# EAGLE design controller4 (EAGLE 8.0.1)

## Sheet 1 of 2
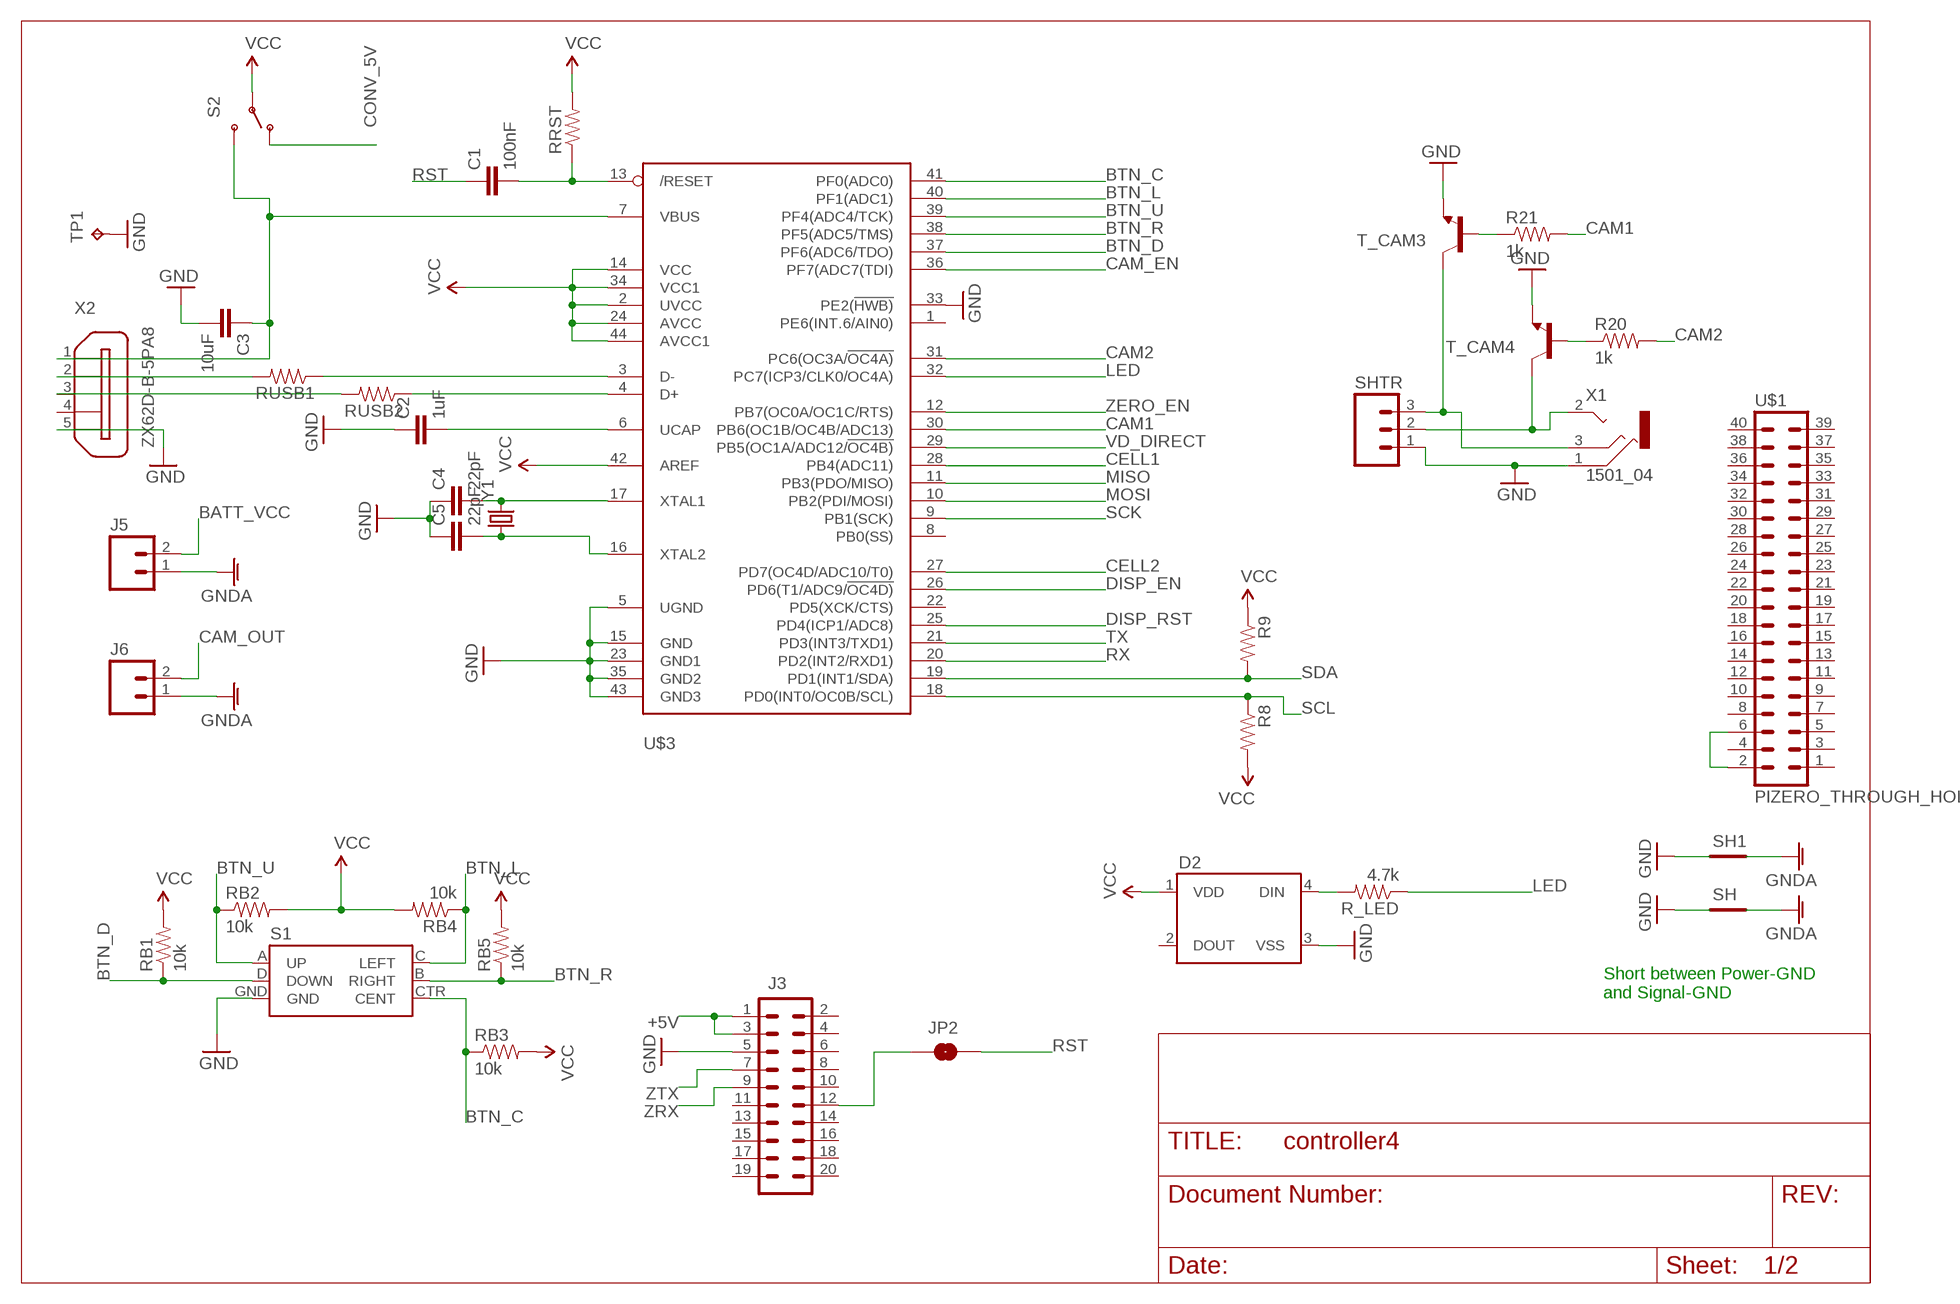
[diagram p0: schematic, sheet 1]

### Parts
C1  100nF  CAP1206  [1206]
C2  1uF  CAP1206  [1206]
C3  10uF  CAP1206  [1206]
C4  22pF  CAP1206  [1206]
C5  22pF  CAP1206  [1206]
D2  WS2812B  [WS2812B]
J3  M10X2  [2X10]
J5  M023.5MM_LOCK  [SCREWTERMINAL-3.5MM-2_LOCK]
J6  M023.5MM_LOCK  [SCREWTERMINAL-3.5MM-2_LOCK]
JP2  JUMPER-PAD-2-NOYES_SILK  [PAD-JUMPER-2-NO_YES_SILK]
R8  RESISTOR1206  [1206]
R9  RESISTOR1206  [1206]
R20  1k  RESISTOR1206  [1206]
R21  1k  RESISTOR1206  [1206]
R_LED  4.7k  RESISTOR1206  [1206]
RB1  10k  RESISTOR1206  [1206]
RB2  10k  RESISTOR1206  [1206]
RB3  10k  RESISTOR1206  [1206]
RB4  10k  RESISTOR1206  [1206]
RB5  10k  RESISTOR1206  [1206]
RRST  RESISTOR1206  [1206]
RUSB1  RESISTOR1206  [1206]
RUSB2  RESISTOR1206  [1206]
S1  JOYSTICK_MINI  [JOYSTICK_MINI]
S2  SWITCH-SPDTPTH_LOCK  [SWITCH-SPDT_LOCK.007S]
SH  SHORT-HT5  [SHORT_TOP-50]
SH1  SHORT-HT5  [SHORT_TOP-50]
SHTR  M03LOCK  [1X03_LOCK]
T_CAM3  TRANSISTOR_NPN2N3904  [TO-92]
T_CAM4  TRANSISTOR_NPN2N3904  [TO-92]
TP1  TPB1,27  [B1,27]
U$1  PIZERO_THROUGH_HOLE  [PIZERO_THOUGH_HOLE]
U$3  ATMEGA32U4-AU  [TQFP44]
X1  1501_04  [1501_05]
X2  ZX62D-B-5PA8  [ZX62D-B-5PA8]
Y1  CRYSTALHC49US  [HC49US]

### Nets
+5V [power]: J3.1 J3.3 ; also sheet 2
BATT_VCC [camera_power]: J5.2 ; also sheet 2
BTN_C: RB3.1 S1.CTR(CENT) U$3.41(PF0(ADC0))
BTN_D: RB1.1 S1.D(DOWN) U$3.37(PF6(ADC6/TDO))
BTN_L: RB4.1 S1.C(LEFT) U$3.40(PF1(ADC1))
BTN_R: RB5.1 S1.B(RIGHT) U$3.38(PF5(ADC5/TMS))
BTN_U: RB2.1 S1.A(UP) U$3.39(PF4(ADC4/TCK))
CAM1: R21.2 U$3.30(PB6(OC1B/OC4B/ADC13))
CAM2: R20.2 U$3.31(PC6(OC3A/!OC4A))
CAM_EN: U$3.36(PF7(ADC7(TDI)) ; also sheet 2
CAM_OUT [camera_power]: J6.2 ; also sheet 2
CELL1: U$3.28(PB4(ADC11)) ; also sheet 2
CELL2: U$3.27(PD7(OC4D/ADC10/T0)) ; also sheet 2
CONV_5V [power]: S2.1(O) ; also sheet 2
DISP_EN: U$3.26(PD6(T1/ADC9/!OC4D)) ; also sheet 2
DISP_RST: U$3.25(PD4(ICP1/ADC8)) ; also sheet 2
GND [power]: C2.1 C3.2 C4.1 C5.1 D2.3(VSS) J3.5 S1.GND SH1.1 SH.1 SHTR.1 T_CAM3.1(E) T_CAM4.1(E) TP1.TP U$3.5(UGND) U$3.15(GND) U$3.23(GND1) U$3.33(PE2(!HWB)) U$3.35(GND2) U$3.43(GND3) X1.1 X2.5 ; also sheet 2
GNDA [camera_power]: J5.1 J6.1 SH1.2 SH.2
LED: R_LED.1 U$3.32(PC7(ICP3/CLK0/OC4A))
MISO: U$3.11(PB3(PDO/MISO)) ; also sheet 2
MOSI: U$3.10(PB2(PDI/MOSI)) ; also sheet 2
N$1: C1.2 RRST.1 U$3.13(/RESET)
N$4: RUSB1.1 U$3.3(D-)
N$5: RUSB2.1 U$3.4(D+)
N$7: D2.4(DIN) R_LED.2
N$8: C4.2 U$3.17(XTAL1) Y1.2
N$9: C5.2 U$3.16(XTAL2) Y1.1
N$10: RUSB1.2 X2.2
N$11: RUSB2.2 X2.3
N$13: J3.12 JP2.1
N$19: U$1.2 U$1.6
N$20: C2.2 U$3.6(UCAP)
N$22: C3.1 S2.3(S) U$3.7(VBUS) X2.1
N$32: R21.1 T_CAM3.2(B)
N$33: SHTR.2 T_CAM4.3(C) X1.2
N$34: SHTR.3 T_CAM3.3(C) X1.3
N$35: R20.1 T_CAM4.2(B)
RST: C1.1 JP2.2 ; also sheet 2
RX: U$3.20(PD2(INT2/RXD1)) ; also sheet 2
SCK: U$3.9(PB1(SCK)) ; also sheet 2
SCL: R8.1 U$3.18(PD0(INT0/OC0B/SCL)) ; also sheet 2
SDA: R9.2 U$3.19(PD1(INT1/SDA)) ; also sheet 2
TX: U$3.21(PD3(INT3/TXD1)) ; also sheet 2
VCC [power]: D2.1(VDD) R8.2 R9.1 RB1.2 RB2.2 RB3.2 RB4.2 RB5.2 RRST.2 S2.2(P) U$3.2(UVCC) U$3.14(VCC) U$3.24(AVCC) U$3.34(VCC1) U$3.42(AREF) U$3.44(AVCC1) ; also sheet 2
VD_DIRECT: U$3.29(PB5(OC1A/ADC12/!OC4B)) ; also sheet 2
ZERO_EN: U$3.12(PB7(OC0A/OC1C/RTS)) ; also sheet 2
ZRX: J3.9 ; also sheet 2
ZTX: J3.7 ; also sheet 2
Unconnected: D2.2(DOUT) J3.2 J3.4 J3.6 J3.8 J3.10 J3.11 J3.13 J3.14 J3.15 J3.16 J3.17 J3.18 J3.19 J3.20 U$1.1 U$1.3 U$1.4 U$1.5 U$1.7 U$1.8 U$1.9 U$1.10 U$1.11 U$1.12 U$1.13 U$1.14 U$1.15 U$1.16 U$1.17 U$1.18 U$1.19 U$1.20 U$1.21 U$1.22 U$1.23 U$1.24 U$1.25 U$1.26 U$1.27 U$1.28 U$1.29 U$1.30 U$1.31 U$1.32 U$1.33 U$1.34 U$1.35 U$1.36 U$1.37 U$1.38 U$1.39 U$1.40 U$3.1(PE6(INT.6/AIN0)) U$3.8(PB0(SS)) U$3.22(PD5(XCK/CTS)) X2.4 X2.S1 X2.S2 X2.S3 X2.S4

### Notes on the sheet
- Short between Power-GND
  and Signal-GND

## Sheet 2 of 2
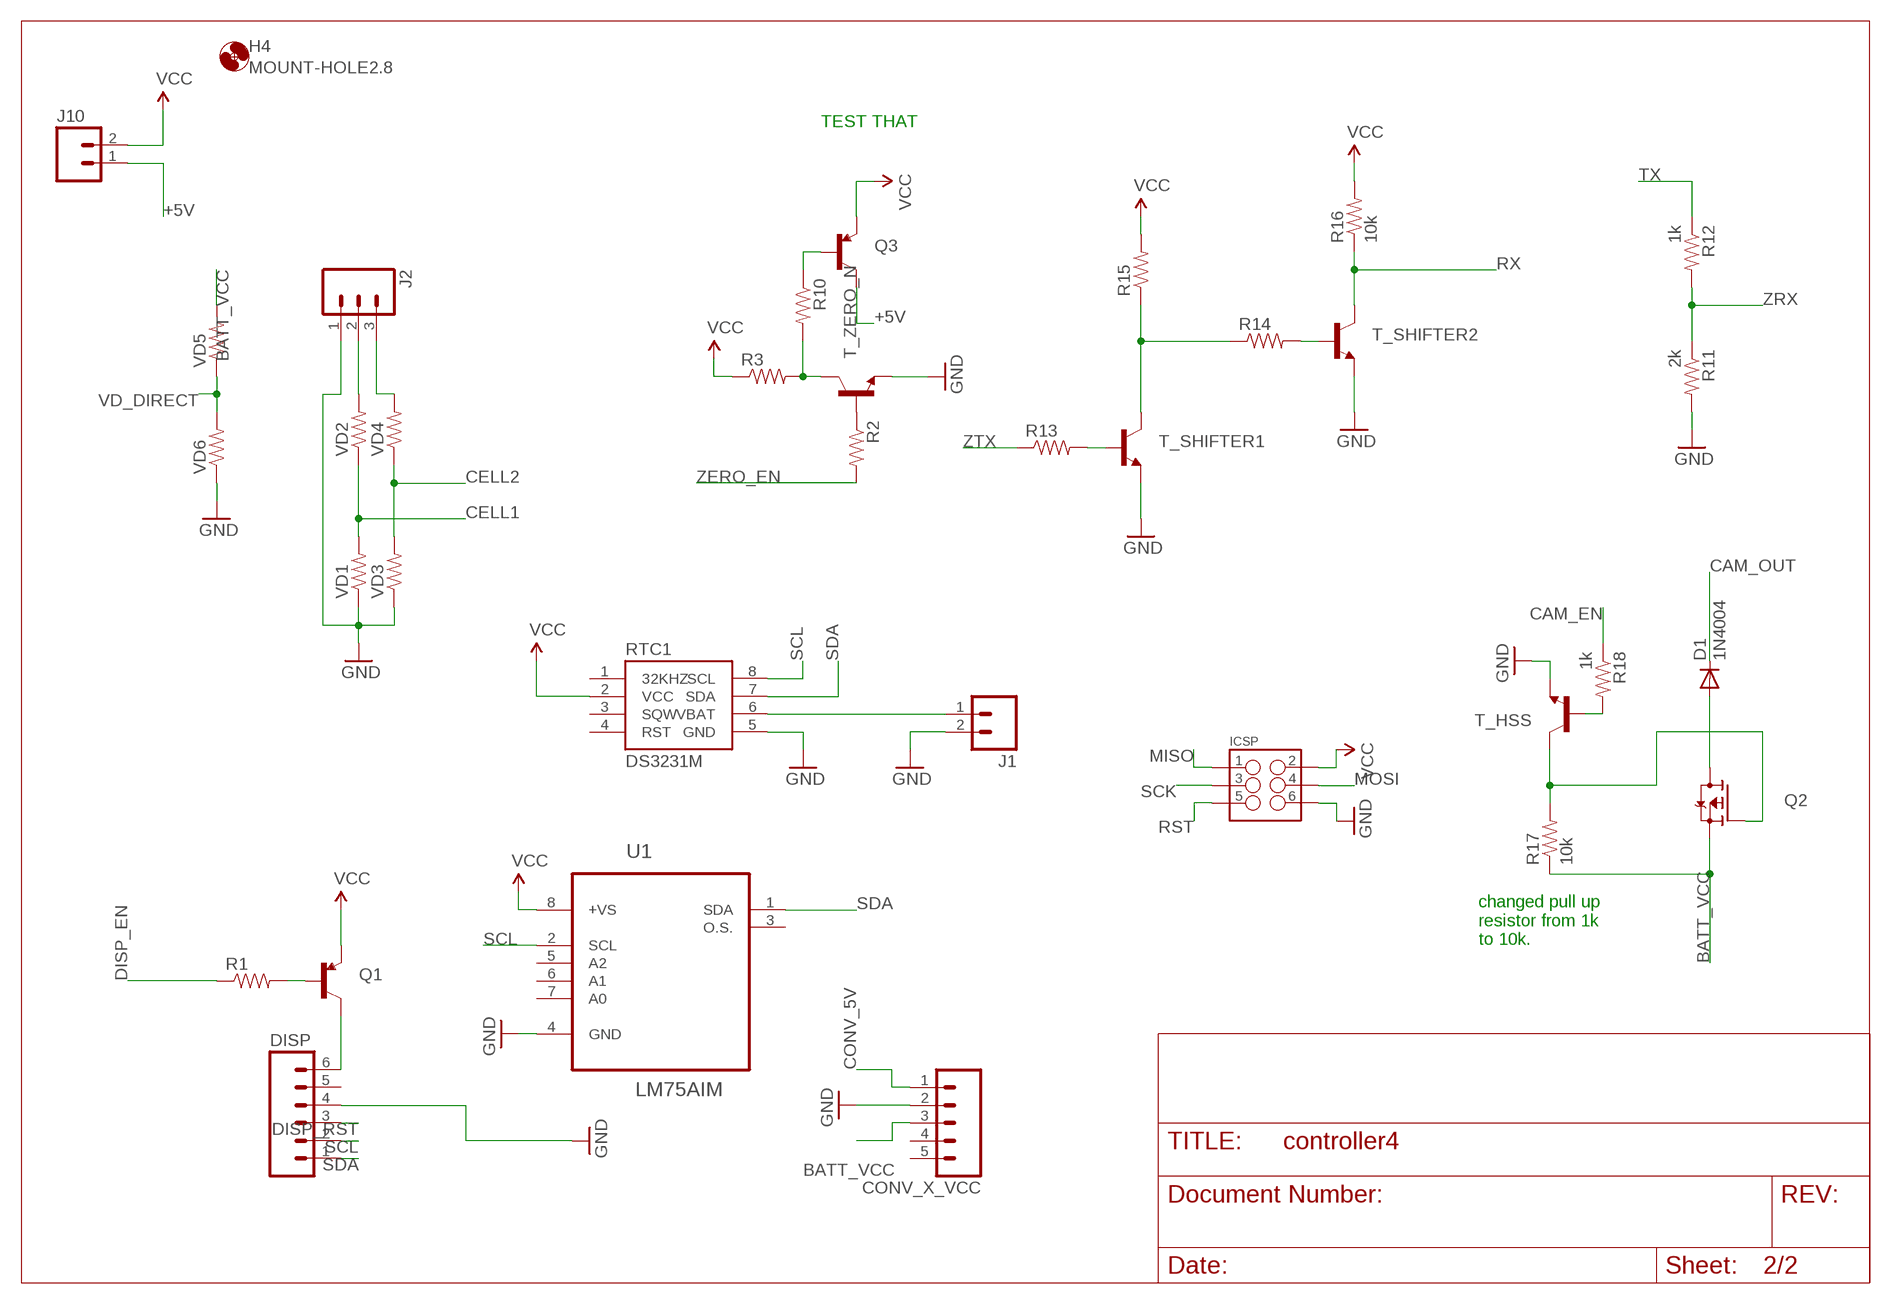
[diagram p1: schematic, sheet 2]

### Parts
CONV_X_VCC  M05LOCK  [1X05_LOCK]
D1  1N4004  [DO41-10]
DISP  M06FEMALE_LOCK  [1X06_FEMALE_LOCK.010]
H4  MOUNT-HOLE2.8  [2,8]
ICSP  M03X2FEMALE  [2X3]
J1  M02LOCK_LONGPADS  [1X02_LOCK_LONGPADS]
J2  M03LOCK  [1X03_LOCK]
J10  M02LOCK  [1X02_LOCK]
Q1  TRANSISTOR_PNPTO92  [TO-92]
Q2  FDD4141TO252  [TO252]
Q3  TRANSISTOR_PNPTO92  [TO-92]
R1  RESISTOR1206  [1206]
R2  RESISTOR1206  [1206]
R3  RESISTOR1206  [1206]
R10  RESISTOR1206  [1206]
R11  2k  RESISTOR1206  [1206]
R12  1k  RESISTOR1206  [1206]
R13  RESISTOR1206  [1206]
R14  RESISTOR1206  [1206]
R15  RESISTOR1206  [1206]
R16  10k  RESISTOR1206  [1206]
R17  10k  RESISTOR1206  [1206]
R18  1k  RESISTOR1206  [1206]
RTC1  DS3231M  [SOIC8]
T_HSS  TRANSISTOR_NPN2N3904  [TO-92]
T_SHIFTER1  TRANSISTOR_NPN2N3904  [TO-92]
T_SHIFTER2  TRANSISTOR_NPN2N3904  [TO-92]
T_ZERO_N  TRANSISTOR_NPN2N3904  [TO-92]
U1  LM75AIM  [SOIC127P620X175-8N]
VD1  RESISTOR1206  [1206]
VD2  RESISTOR1206  [1206]
VD3  RESISTOR1206  [1206]
VD4  RESISTOR1206  [1206]
VD5  RESISTOR1206  [1206]
VD6  RESISTOR1206  [1206]

### Nets
+5V [power]: J10.1 Q3.3(C) ; also sheet 1
BATT_VCC [camera_power]: CONV_X_VCC.3 Q2.2(S) R17.1 VD5.2 ; also sheet 1
CAM_EN: R18.1 ; also sheet 1
CAM_OUT [camera_power]: D1.C ; also sheet 1
CELL1: VD1.2 VD2.1 ; also sheet 1
CELL2: VD3.2 VD4.1 ; also sheet 1
CONV_5V [power]: CONV_X_VCC.1 ; also sheet 1
DISP_EN: R1.1 ; also sheet 1
DISP_RST: DISP.3 ; also sheet 1
GND [power]: CONV_X_VCC.2 DISP.4 ICSP.6 J1.2 J2.1 R11.2 RTC1.5(GND) T_HSS.1(E) T_SHIFTER1.1(E) T_SHIFTER2.1(E) T_ZERO_N.1(E) U1.4(GND) VD1.1 VD3.1 VD6.1 ; also sheet 1
MISO: ICSP.1 ; also sheet 1
MOSI: ICSP.4 ; also sheet 1
N$2: J2.3 VD4.2
N$3: J2.2 VD2.2
N$6: DISP.6 Q1.3(C)
N$12: Q1.2(B) R1.2
N$14: R2.1 T_ZERO_N.2(B)
N$15: Q3.2(B) R10.1
N$16 [camera_power]: D1.A Q2.3(D)
N$17: R13.2 T_SHIFTER1.2(B)
N$18: R3.2 R10.2 T_ZERO_N.3(C)
N$23: R14.1 R15.1 T_SHIFTER1.3(C)
N$24: R14.2 T_SHIFTER2.2(B)
N$31: R18.2 T_HSS.2(B)
N$36: Q2.1(G) R17.2 T_HSS.3(C)
RST: ICSP.5 ; also sheet 1
RX: R16.1 T_SHIFTER2.3(C) ; also sheet 1
SCK: ICSP.3 ; also sheet 1
SCL: DISP.2 RTC1.8(SCL) U1.2(SCL) ; also sheet 1
SDA: DISP.1 RTC1.7(SDA) U1.1(SDA) ; also sheet 1
TX: R12.1 ; also sheet 1
VBAT: J1.1 RTC1.6(VBAT)
VCC [power]: ICSP.2 J10.2 Q1.1(E) Q3.1(E) R3.1 R15.2 R16.2 RTC1.2(VCC) U1.8(+VS) ; also sheet 1
VD_DIRECT: VD5.1 VD6.2 ; also sheet 1
ZERO_EN: R2.2 ; also sheet 1
ZRX: R11.1 R12.2 ; also sheet 1
ZTX: R13.1 ; also sheet 1
Unconnected: CONV_X_VCC.4 CONV_X_VCC.5 DISP.5 RTC1.1(32KHZ) RTC1.3(SQW) RTC1.4(RST) U1.3(O.S.) U1.5(A2) U1.6(A1) U1.7(A0)

### Notes on the sheet
- TEST THAT
- changed pull up
  resistor from 1k
  to 10k.

## Library data of the parts
C1 C3-C5 = SparkFun-Passives:CAP: Capacitor Standard 0603 ceramic capacitor, and 0.1" leaded capacitor.
C2 = SparkFun-Capacitors:CAP: Capacitor Standard 0603 ceramic capacitor, and 0.1" leaded capacitor.
CONV_X_VCC = SparkFun-Connectors:M05: Header 5 Standard 5-pin 0.1" header. Use with straight break away headers (SKU : PRT-00116), right angle break away headers (PRT-00553), swiss pins (PRT-00743), machine pins (PRT-00117), and female headers (PRT-00115). Molex polarized connector foot print use with SKU : PRT-08230 with associated crimp pins and housings.
D1 = adafruit:1N4004: DIODE General purpose 1N400x type rectifier (With bigger pads) http://www.ladyada.net/library/pcb/eaglelibrary.html
D2 = SparkFun-LED:WS2812B: WS2812B - Intelligent control LED integrated light source Technical Specifications: Power Supply Voltage (VDD): 3.5 to 5.3 V Input Voltage (VI): -0.5 to VDD+0.5 V Operating Junction Temperature (Topt): -25°C to +80°C Storage Temperature Range (Tstg): -55°C to +150°C; PROD_ID: DIO-12503
DISP = SparkFun-Connectors:M06: Header 6 Standard 6-pin 0.1" header. Use with straight break away headers (SKU : PRT-00116), right angle break away headers (PRT-00553), swiss pins (PRT-00743), machine pins (PRT-00117), and female headers (PRT-00115). Molex polarized connector foot print use with SKU : PRT-08094 with associated crimp pins and housings. NOTES ON THE VARIANTS LOCK and LOCK_LONGPADS... This footprint was designed to help hold the alignment of a through-hole component (i.e. 6-pin header) while soldering it into place. You may notice that each hole has been shifted either up or down by 0.005 of an inch from it's more standard position (which is a perfectly straight line). This slight alteration caused the pins (the squares in the middle) to touch the edges of the holes. Because they are alternating, it causes a "brace" to hold the component in place. 0.005 has proven to be the perfect amount of "off-center" position when using our standard breakaway headers. Although looks a little odd when you look at the bare footprint, once you have a header in there, the alteration is very hard to notice. Also,if you push a header all the way into place, it is covered up entirely on the bottom side. This idea of altering the position of holes to aid alignment will be further integrated into the Sparkfun Library for other footprints. It can help hold any component with 3 or more connection pins.
H4 = holes:MOUNT-HOLE: MOUNTING HOLE with drill center marker
ICSP = SparkFun-Connectors:M03X2: 2x3 .1" header. Shrouded, with keying- CONN-10681 SMT- CONN-11415 Pogo pins- HW-11044; PROD_ID: CONN-11566; VALUE: FEMALE 2x3
J1 J10 = SparkFun-Connectors:M02: Standard 2-pin 0.1" header. Use with - straight break away headers ( PRT-00116) - right angle break away headers (PRT-00553) - swiss pins (PRT-00743) - machine pins (PRT-00117) - female headers (PRT-00115) Molex polarized connector foot print use with: PRT-08233 with associated crimp pins and housings. 2.54_SCREWTERM for use with PRT-10571. 3.5mm Screw Terminal footprints for PRT-08084 5mm Screw Terminal footprints for use with PRT-08432
J2 SHTR = SparkFun-Connectors:M03: Header 3 Standard 3-pin 0.1" header. Use with straight break away headers (SKU : PRT-00116), right angle break away headers (PRT-00553), swiss pins (PRT-00743), machine pins (PRT-00117), and female headers (PRT-00115). Molex polarized connector foot print use with SKU : PRT-08232 with associated crimp pins and housings.
J3 = SparkFun-Connectors:M10X2: This was SPECIALLY designed to be used with our Graphic LCD Backpack. Be sure you want to use this! It is not only staggered on each line of header holes, but IT IS ALSO offset of the center point of the top and bottom lines by 5 mil. This causes the headers to lock into place on the "standard" footprint on the LCD screen. The extra squares on the tdocu layer are there simply to reference other pins (if you were to actually populate a longer header than ten long - this is what we do with the backpacks).
J5 J6 = SparkFun-Connectors:M02: Standard 2-pin 0.1" header. Use with - straight break away headers ( PRT-00116) - right angle break away headers (PRT-00553) - swiss pins (PRT-00743) - machine pins (PRT-00117) - female headers (PRT-00115) Molex polarized connector foot print use with: PRT-08233 with associated crimp pins and housings. 2.54_SCREWTERM for use with PRT-10571. 3.5mm Screw Terminal footprints for PRT-08084 5mm Screw Terminal footprints for use with PRT-08432; PROD_ID: CONN-08399
JP2 = SparkFun-Passives:JUMPER-PAD-2-NO
Q1 Q3 = SparkFun-DiscreteSemi:TRANSISTOR_PNP: Generic PNP BJT Double check pinouts against datasheets- not all devices are the same! MMBT3906 - 40V 200mA SOT-23 (TRANS-08052) MMBT4403 - 40V 600mA SOT-23 (TRANS-09245)
Q2 = transistor-fet:FDD4141: P-Channel PowerTrench® MOSFET Source: FDD4141.pdf
R1-R3 R10-R18 R20 R21 R_LED RB1-RB5 = SparkFun-Resistors:RESISTOR: Resistor Basic schematic elements and footprints for 0603, 1206, and PTH resistors.
R8 R9 RRST RUSB1 RUSB2 VD1-VD6 = SparkFun-Passives:RESISTOR: Resistor Basic schematic elements and footprints for 0603, 1206, and PTH resistors.
RTC1 = SparkFun-DigitalIC:DS3231M: DS3231M Real Time Clock. Accuracy +/-5ppm. Battery Backup. 2.3V to 5.5V.; PROD_ID: IC-11985
S1 = SparkFun-Electromechanical:JOYSTICK_MINI: Small 5-way tactile joystick, COM-10063 4UCON SF303GJ26; PROD_ID: SWCH-09905
S2 = SparkFun-Electromechanical:SWITCH-SPDT: SPDT Switch Simple slide switch, Spark Fun Electronics SKU : COM-00102 DPDT SMT slide switch, AYZ0202, SWCH-08179
SH SH1 = shorts-old:SHORT-H: Short between two nets; BOM: no
T_CAM3 T_CAM4 T_HSS T_SHIFTER1 T_SHIFTER2 T_ZERO_N = SparkFun-DiscreteSemi:TRANSISTOR_NPN: Generic NPN BJT MMBT2222A - TRANS-08049 (SOT-23, 1A 40V) MPSA42 - TRANS-09116 (SOT-23, 500mA 300V) MMBT5088LT1G - TRANS-11160 (SOT-23, 50 mA 30V) BC547 - COM-08928 <http://www.sparkfun.com/products/8928> (TO-92 45V 100mA) (1.Collector 2.Base 3.Emitter) 2N3904 - COM-00521 <http://www.sparkfun.com/products/521> (TO-92 40V 200mA) (1.Emitter 2.Base 3.Collector) P2N2222A - COM-12852 <http://www.sparkfun.com/products/12852> (TO-92 40V 600mA) (1.Collector 2.Base 3.Emitter); PROD_ID: TRANS-08447
TP1 = testpad:TP: Test pad
U1 = NSC_By_element14_Batch_1.1:LM75AIM: Digital Temperature Sensor; MPN: LM75AIM; OC_FARNELL: 1699380; OC_NEWARK: -; PACKAGE: SOIC-8; SUPPLIER: NATIONAL SEMICONDUCTOR
U$1 = pizero:PIZERO_THROUGH_HOLE
U$3 = adafruit:ATMEGA32U4: http://www.ladyada.net/library/eagle
X1 = con-lumberg:1501_0*: Jack connectors according to JISC 6560, 2.5 mm Klinkensteckverbinder nach JISC 6560, 2,5 mm Source: http://www.lumberg.com/Produkte/PDFs/1501_05.pdfedit 1501_03 http://www.lumberg.com/Produkte/PDFs/1501_06.pdf; OC_FARNELL: 1216977; OC_NEWARK: unknown
X2 = zx62d-b-5pa8-oshpark_10:ZX62D-B-5PA8: Micro USB Type B Connector - Standard, Shell Through Hole Source: http://www.hirose.co.jp/cataloge_hp/ed_ZX_20140804.pdf; MF: Hirose; MPN: ZX62D-B-5PA8; OC_FARNELL: 2300438; OC_NEWARK: 69W0712
Y1 = SparkFun-FreqCtrl:CRYSTAL: Various standard crystals. Proven footprints.

## Net classes
0 default: width 0.305 mm, clearance 0.254 mm
1 power: width 0.356 mm, clearance 0.254 mm
2 camera_power: width 0.914 mm, clearance 0.254 mm
3 usbsignal: width 0.305 mm, clearance 0.254 mm

## Board
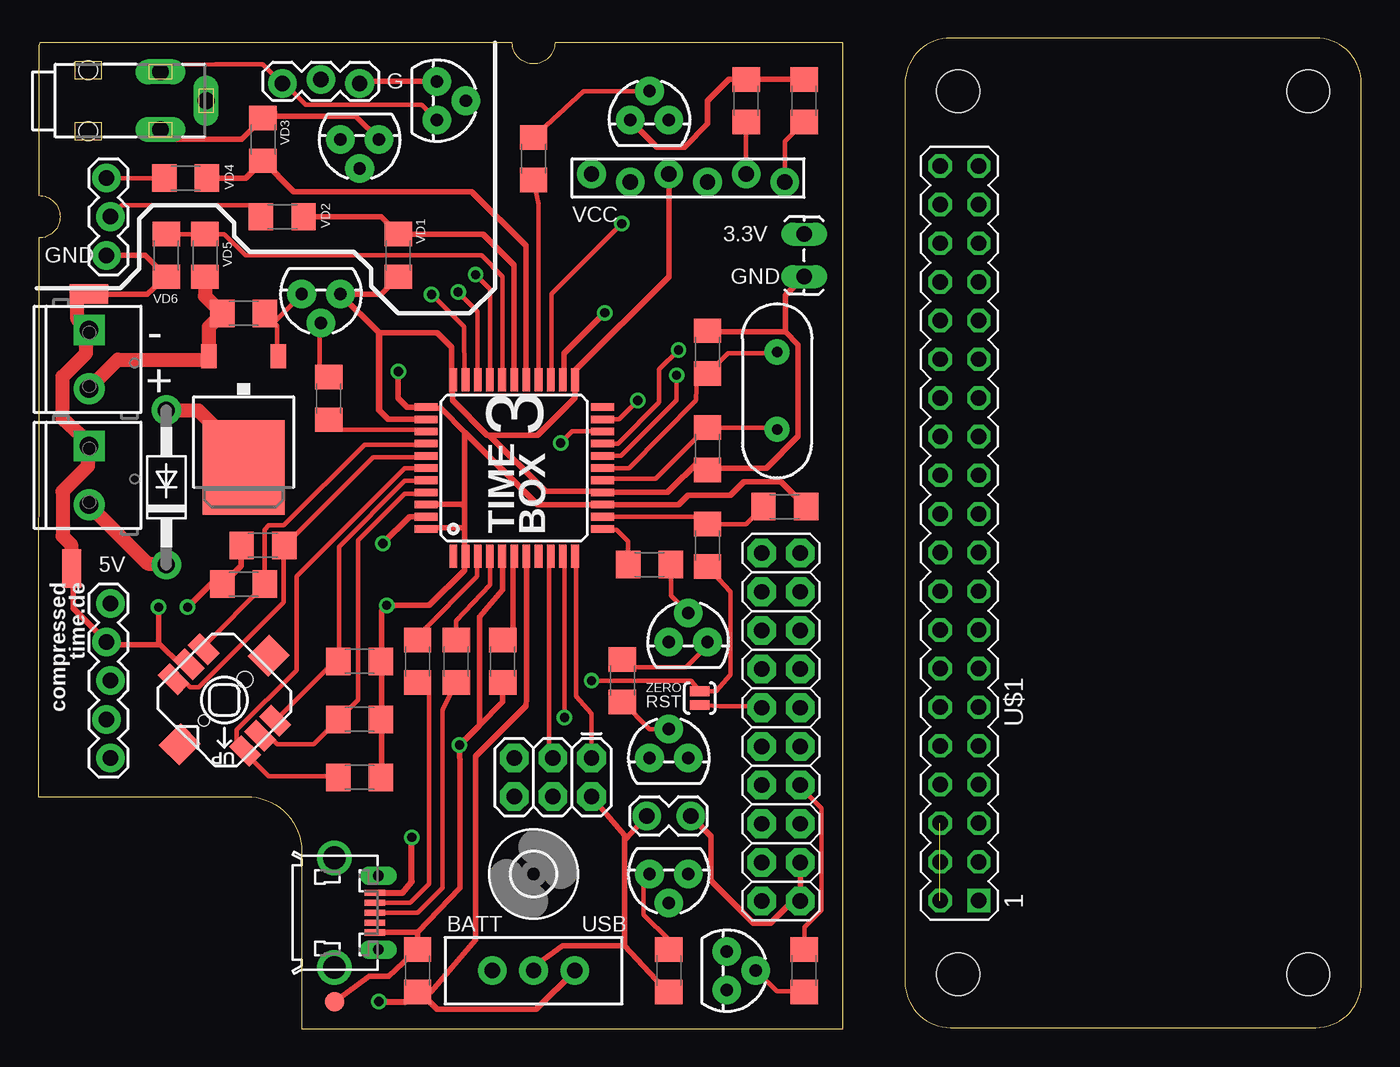
[diagram p2: board, top side]
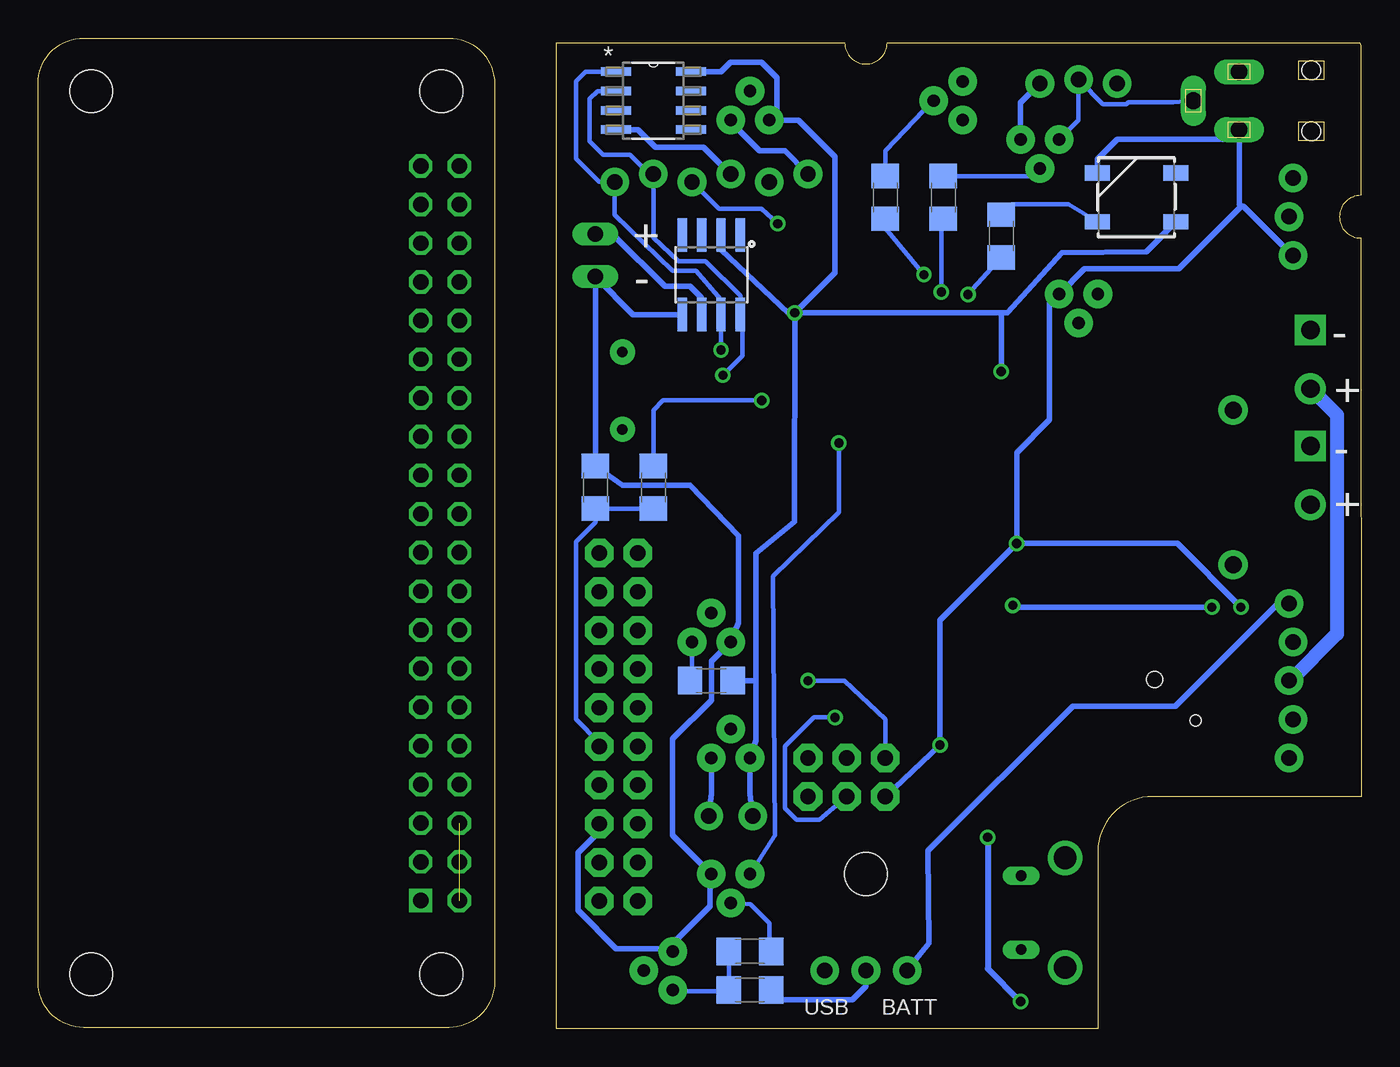
[diagram p3: board, bottom side, seen from below]

Size 86.97 x 65.08 mm. Coordinates in mm from the lower left corner, seen from the top.
Outline: 13.9,15.24 12.24,15.24 0,15.25 0.05,51.94 arc180 0.05,54.74 0.05,64.57 0.13,64.77 31.17,64.77 arc180 33.96,64.77 52.88,64.77 52.88,0.01 17.32,0 17.32,11.69
Outline: 13.69,15.25 arc-90 17.33,11.66
Copper layers (1*16): Top 0.035mm / dielectric 1.5mm / Bottom 0.035mm
Design rules "default": minimum track width 10mil, minimum drill 24mil, track to track 8mil, track to pad 8mil, pad to pad 8mil, via to via 8mil, smd to smd 8mil, copper to edge 40mil, drill to drill 8mil, minimum pad ring 10mil, minimum via ring 8mil, stop-mask expansion 4mil, vias tented up to drill 0mil, thermal gap 10mil

### Footprints (pad centres in the part's own frame; a part is rotated, then mirrored left to right if it is on the bottom)
1206 = smd 1.6 x 1.8: 1 -1.4,0; 2 1.4,0
1X05_LOCK = drill 1.016 pad 1.88: 1 0,0.127; 2 2.54,-0.127; 3 5.08,0.127; 4 7.62,-0.127; 5 10.16,0.127
DO41-10 = drill 1.118 pad 1.93: A 5.08,0; C -5.08,0
WS2812B = smd 1.651 x 1: 1 -2.577,1.6; 2 -2.577,-1.6; 3 2.577,-1.6; 4 2.577,1.6
1X06_FEMALE_LOCK.010 = drill 1.016 pad 1.88: 1 0,0.254; 2 2.54,-0.254; 3 5.08,0.254; 4 7.62,-0.254; 5 10.16,0.254; 6 12.7,-0.254
2,8 = hole 2.8: 0,0
2X3 = drill 1.016 pad 1.88 octagon: 1 0,0; 2 0,2.54; 3 2.54,0; 4 2.54,2.54; 5 5.08,0; 6 5.08,2.54
1X02_LOCK_LONGPADS = drill 1.016 long: 1 -0.127,0; 2 2.667,0
1X03_LOCK = drill 1.016 pad 1.88: 1 0,0.127; 2 2.54,-0.127; 3 5.08,0.127
2X10 = drill 1.016 pad 1.88 octagon: 1 -11.43,-1.27; 2 -11.43,1.27; 3 -8.89,-1.27; 4 -8.89,1.27; 5 -6.35,-1.27; 6 -6.35,1.27; 7 -3.81,-1.27; 8 -3.81,1.27; 9 -1.27,-1.27; 10 -1.27,1.27; 11 1.27,-1.27; 12 1.27,1.27; 13 3.81,-1.27; 14 3.81,1.27; 15 6.35,-1.27; 16 6.35,1.27; 17 8.89,-1.27; 18 8.89,1.27; 19 11.43,-1.27; 20 11.43,1.27
SCREWTERMINAL-3.5MM-2_LOCK = drill 1.2 pad 2.032 square: 1 -0.178,0 | drill 1.2 pad 2.032: 2 3.678,0
1X02_LOCK = drill 1.016 pad 1.88: 1 -0.178,0; 2 2.718,0
PAD-JUMPER-2-NO_YES_SILK = smd 0.635 x 1.27: 1 -0.45,0; 2 0.45,0
TO-92 = drill 0.813 pad 1.88: 1 -1.27,0; 2 0,1.905; 3 1.27,0
TO252 = smd 1 x 1.6: 1 -2.28,-4.8; 2 2.28,-4.8 | smd 5.4 x 6.2: 3 0,2.5
SOIC8 = smd 0.61 x 2.21: 1 -1.905,-2.616; 2 -0.635,-2.616; 3 0.635,-2.616; 4 1.905,-2.616; 5 1.905,2.616; 6 0.635,2.616; 7 -0.635,2.616; 8 -1.905,2.616
JOYSTICK_MINI = smd 1.85 x 1.1: A -3.325,1.4; B 3.325,1.4; C -3.325,-1.4; CTR -3.325,0; D 3.325,-1.4; GND 3.325,0 | smd 1.9 x 2: NC 0,4.13; NC@0 0,-4.13 | hole 0.75: 0,1.9 | hole 1.05: 0,-1.9
SWITCH-SPDT_LOCK.007S = drill 1.016 pad 1.88: 1 0,2.718; 2 0,0; 3 0,-2.718
SHORT_TOP-50 = smd 1.27 x 1.27: 1 0.635,0; 2 -0.635,0
B1,27 = smd 1.27 x 1.27: TP 0,0
SOIC127P620X175-8N = smd 1.981 x 0.559: 1 -2.464,1.905; 2 -2.464,0.635; 3 -2.464,-0.635; 4 -2.464,-1.905; 5 2.464,-1.905; 6 2.464,-0.635; 7 2.464,0.635; 8 2.464,1.905
PIZERO_THOUGH_HOLE = drill 1.016 square: 1 8.34,25.15 | drill 1.016 octagon: 2 8.34,27.69; 3 10.88,25.15; 4 10.88,27.69; 5 13.42,25.15; 6 13.42,27.69; 7 15.96,25.15; 8 15.96,27.69; 9 18.5,25.15; 10 18.5,27.69; 11 21.04,25.15; 12 21.04,27.69; 13 23.58,25.15; 14 23.58,27.69; 15 26.12,25.15; 16 26.12,27.69; 17 28.66,25.15; 18 28.66,27.69; 19 31.2,25.15; 20 31.2,27.69; 21 33.74,25.15; 22 33.74,27.69; 23 36.28,25.15; 24 36.28,27.69; 25 38.82,25.15; 26 38.82,27.69; 27 41.36,25.15; 28 41.36,27.69; 29 43.9,25.15; 30 43.9,27.69; 31 46.44,25.15; 32 46.44,27.69; 33 48.98,25.15; 34 48.98,27.69; 35 51.52,25.15; 36 51.52,27.69; 37 54.06,25.15; 38 54.06,27.69; 39 56.6,25.15; 40 56.6,27.69 | hole 2.8: 3.5,3.5; 3.5,26.5; 61.5,26.5; 61.5,3.5
TQFP44 = smd 1.5 x 0.5: 1 -5.8,4; 2 -5.8,3.2; 3 -5.8,2.4; 4 -5.8,1.6; 5 -5.8,0.8; 6 -5.8,0; 7 -5.8,-0.8; 8 -5.8,-1.6; 9 -5.8,-2.4; 10 -5.8,-3.2; 11 -5.8,-4; 23 5.8,-4; 24 5.8,-3.2; 25 5.8,-2.4; 26 5.8,-1.6; 27 5.8,-0.8; 28 5.8,0; 29 5.8,0.8; 30 5.8,1.6; 31 5.8,2.4; 32 5.8,3.2; 33 5.8,4 | smd 0.5 x 1.5: 12 -4,-5.8; 13 -3.2,-5.8; 14 -2.4,-5.8; 15 -1.6,-5.8; 16 -0.8,-5.8; 17 0,-5.8; 18 0.8,-5.8; 19 1.6,-5.8; 20 2.4,-5.8; 21 3.2,-5.8; 22 4,-5.8; 34 4,5.8; 35 3.2,5.8; 36 2.4,5.8; 37 1.6,5.8; 38 0.8,5.8; 39 0,5.8; 40 -0.8,5.8; 41 -1.6,5.8; 42 -2.4,5.8; 43 -3.2,5.8; 44 -4,5.8
1501_05 = drill 1.1 pad 1.4 long: 1 -1.9,-8.5; 2 0,-11.5; 3 1.9,-8.5 | hole 1.2: -2,-3.75; 2,-3.75
ZX62D-B-5PA8 = smd 1.35 x 0.4: 1 4.825,1.3; 2 4.825,0.65; 3 4.825,0; 4 4.825,-0.65; 5 4.825,-1.3 | drill 1.5: S1 2.15,-3.6; S2 2.15,3.6 | drill 0.7 long: S3 5.05,2.425; S4 5.05,-2.425
HC49US = drill 0.7 pad 1.651: 1 -2.54,0; 2 2.54,0

### Placement (x,y rotation side)
C1  43.99,31.75 90 top
C2  30.53,24.13 90 top
C3  24.94,3.81 90 top
C4  43.99,44.45 270 top
C5  43.99,38.1 90 top
CONV_X_VCC  4.62,27.94 270 top
D1  8.43,35.56 90 top
D2  14.78,54.61 180 bottom
DISP  49.07,55.88 180 top
H4  32.56,10.16 180 top
ICSP  36.37,17.78 180 top
J1  50.34,52.07 270 top
J2  4.62,50.8 90 top
J3  48.82,19.81 90 top
J5  3.35,45.72 270 top
J6  3.35,38.1 270 top
J10  42.72,13.97 180 top
JP2  43.48,21.72 90 top
Q1  40.18,59.69 0 top
Q2  13.51,39.37 180 top
Q3  41.45,17.78 0 top
R1  32.56,57.15 90 top
R2  40.18,30.48 180 top
R3  42.72,22.86 180 bottom
R8  46.53,60.96 90 top
R9  50.34,60.96 270 top
R10  38.41,22.86 90 top
R11  50.34,35.56 90 bottom
R12  46.53,35.56 270 bottom
R13  50.34,3.81 270 top
R14  40.18,5.08 0 bottom
R15  40.18,2.54 0 bottom
R16  41.45,3.81 270 top
R17  13.51,46.99 0 top
R18  19.1,41.4 90 top
R20  27.48,54.61 270 bottom
R21  31.29,54.61 270 bottom
R_LED  23.67,52.07 90 bottom
RB1  13.51,29.21 180 top
RB2  21.13,16.51 0 top
RB3  21.13,20.32 0 top
RB4  21.13,24.13 0 top
RB5  14.78,31.75 180 top
RRST  49.07,34.29 0 top
RTC1  42.72,49.53 180 bottom
RUSB1  24.94,24.13 270 top
RUSB2  27.48,24.13 270 top
S1  12.24,21.59 135 top
S2  32.56,3.81 90 top
SH  2.21,30.23 270 top
SH1  3.35,48.26 0 top
SHTR  21.13,62.23 180 top
T_CAM3  26.21,60.96 270 top
T_CAM4  21.13,58.42 180 top
T_HSS  18.59,48.26 180 top
T_SHIFTER1  45.26,3.81 270 top
T_SHIFTER2  41.45,10.16 180 top
T_ZERO_N  42.72,25.4 0 top
TP1  19.48,1.78 180 top
U1  46.53,60.96 0 bottom
U$1  86.97,0.08 90 top
U$3  31.29,36.83 90 top
VD1  23.67,50.8 90 top
VD2  16.05,53.34 180 top
VD3  14.78,58.42 270 top
VD4  9.7,55.88 180 top
VD5  10.97,50.8 270 top
VD6  8.43,50.8 90 top
X1  -0.46,60.96 90 top
X2  17.32,7.62 0 top
Y1  48.56,41.91 90 top

### Tracks (layer width: path | path; a pad name or v marks a point on that pad's centre or on a via)
+5V
  Top 0.356: J3.3 J3.1 49.95,8.33 49.53,8.33 48.13,6.93 47.02,6.93 44.22,9.73 44.22,12.65 J10.1
  Bottom 0.356: Q3.3 42.72,15.42 J10.1
BATT_VCC
  Top 0.914: J5.2 3.43,42.14 5.25,43.95 10.83,43.95 Q2.2 11.23,46.11 R17.1 10.97,48.13 VD5.2
  Bottom 0.914: CONV_X_VCC.3 4.69,22.86 1.61,25.93 1.61,40.32 3.29,42 J5.2
BTN_C
  Top 0.305: U$3.41 25.36,35.15 24.11,35.15 21.03,32.08 21.03,21.6 19.77,20.34 RB3.1 19.63,20.21 18.1,18.67 15.72,18.67 15.16,19.23 14.6,19.23 S1.CTR
BTN_D
  Top 0.305: U$3.37 25.36,38.37 21.45,38.37 16.14,33.06 15.16,33.06 14.88,32.78 14.88,29.29 RB1.1 14.88,29.15 10.97,25.23 10.97,24.96 S1.D
BTN_L
  Top 0.305: U$3.40 25.36,35.99 24.11,35.99 19.77,31.66 19.77,24.26 RB4.1 19.63,24.26 15.72,20.34 S1.C
BTN_R
  Top 0.305: U$3.38 25.36,37.53 22.01,37.53 16.28,31.8 RB5.1 16.14,31.66 16.14,28.03 10.55,22.44 9.99,22.44 9.58,22.86 9.02,22.86 S1.B
BTN_U
  Top 0.305: U$3.39 24.11,36.83 16.98,29.7 16.98,23.56 13.07,19.65 13.07,18.67 13.49,18.25 S1.A 13.63,18.11 15.16,16.57 19.63,16.57 RB2.1
CAM1  (via drill 0.61)
  Top 0.305: U$3.30 29.69,48.59 v28.75,49.53
  Bottom 0.305: v28.75,49.53 31.29,52.58 R21.2
CAM2  (via drill 0.61)
  Top 0.305: U$3.31 28.89,47.1 v27.61,48.39
  Bottom 0.305: v27.61,48.39 27.61,52.58 R20.2
CAM_EN
  Top 0.305: U$3.36 25.36,39.34 19.77,39.34 18.66,40.46 R18.1
CAM_OUT
  Top 0.914: D1.C 8.32,30.54 7.21,30.54 3.43,34.33 J6.2
CELL1
  Top 0.356: VD2.1 22.53,53.34 VD1.2 29.26,52.2 31.29,50.16 U$3.28
CELL2
  Top 0.305: 32.05,42.67 U$3.27
  Top 0.356: VD4.1 13.64,55.88 VD3.2 16.81,54.99 28.5,54.99 32.05,51.44 32.05,42.67
CONV_5V
  Bottom 0.356: S2.1 29.83,3.86 28.43,5.61 28.5,11.68 18.96,21.18 12.23,21.18 5.53,27.89 4.8,27.89 CONV_X_VCC.1
DISP_EN
  Top 0.305: U$3.26 32.89,54.15 R1.1
DISP_RST  (via drill 0.61 pad 0.41)
  Top 0.305: v38.35,52.88 33.74,48.27 33.74,42.7 U$3.25
  Bottom 0.305: v38.35,52.88 39.42,53.85 42.21,53.85 DISP.3
GND  (via drill 0.61, 0.61 pad 0.41)
  Top 0.356: U$3.5 30.53,31.1 30.53,28.83 29.01,27.05 29.01,19.94 | 49.11,45.77 44.08,45.77 C4.1 | 49.11,45.77 49.95,44.93 49.95,38.92 47.85,36.83 44.08,36.83 C5.1 43.48,37.21 43.48,37.34 41.38,35.23 U$3.15 36.96,35.29 33.34,35.29 29.64,38.99 | SH.1 2.31,29.57 2.31,27.61 4.41,25.51 CONV_X_VCC.2 4.55,25.23 8.04,25.23 | 8.04,25.23 9.3,23.98 9.85,23.98 S1.GND | 24.66,40.04 25.36,40.04 U$3.35 23.01,40.03 22.4,40.64 | 27.18,42.42 27.18,41.91 | 27.18,41.91 27.18,41.86 | 27.18,42.42 U$3.33 | TP1.TP 21.77,3.43 23.04,3.43 C3.2 24.94,6.35 | 24.94,6.35 27.74,9.27 27.74,16.89 v27.7,18.63 29.01,19.94 | X2.5 23.45,6.35 24.94,6.35 | 27.18,42.42 27.18,44.76 26.21,45.72 22.4,45.72 T_HSS.1 22.53,48.26 VD1.1 | 29.64,38.99 32.82,38.99 35.28,41.45 35.28,42.56 U$3.23 35.23,42.69 35.23,43.18 41.45,49.4 DISP.4 | 27.18,41.91 27.23,41.86 27.23,41.27 29.52,38.99 29.64,38.99 | U$3.43 24.41,33.63 v22.66,31.88 | SH1.1 7.16,48.26 VD6.1 7.03,50.8 J2.1 | 15.29,59.94 15.17,59.82 VD3.1 13.38,58.42 8.43,58.42 8.04,58.81 X1.1 | 15.29,59.94 15.54,60.2 | T_CAM4.1 20.88,59.94 15.29,59.94 | v7.92,27.69 7.92,25.35 8.04,25.23 | C2.1 30.53,21.46 29.01,19.94 | T_CAM3.1 21.26,62.23 SHTR.1 | J1.2 49.11,48.17 49.11,45.77
  Top 0.417: 22.4,40.64 22.4,45.72
  Bottom 0.356: J3.5 50.09,12.94 51.49,11.54 51.49,7.77 48.97,5.26 45.48,5.26 45.34,5.12 T_SHIFTER1.1 45.48,5.4 42.82,8.05 42.82,10.13 T_SHIFTER2.1 45.26,12.7 45.26,19.05 42.72,21.59 42.72,24.13 T_ZERO_N.1 40.95,26.67 40.95,32.38 44.12,35.69 48.56,35.69 R11.2 J1.2 47.85,46.91 RTC1.5 | J2.1 4.55,50.8 7.76,54.01 7.89,54.01 | v22.66,31.88 22.66,37.85 20.5,40.01 20.5,47.62 T_HSS.1 18.21,49.91 11.99,49.91 7.89,54.01 | v22.66,31.88 12.12,31.88 v7.92,27.69 | ICSP.6 v27.7,18.63 27.7,26.84 v22.66,31.88 | SHTR.1 22.4,60.83 T_CAM4.1 | 7.89,54.01 8.04,54.17 X1.1 8.43,58.67 8.43,58.42 16.05,58.42 17.36,57.11 D2.3 | DISP.4 43.23,57.91 46.41,57.91 47.55,59.05 U1.4
GNDA
  Top 0.914: SH1.2 2.59,48.15 2.59,46.61 3.29,45.91 J5.1 3.15,45.49 3.15,44.37 1.61,42.84 1.61,40.07 3.15,38.66 J6.1 3.29,36.97 1.61,35.29 1.61,32.36 2.17,31.8 2.17,30.96 SH.2
LED  (via drill 0.61)
  Top 0.305: v25.86,48.23 27.99,46.1 28.02,42.7 U$3.32
  Bottom 0.305: v25.86,48.23 23.69,50.66 R_LED.1
MISO
  Top 0.305: U$3.11 35.36,30.97 35.36,21.84 36.37,20.7 ICSP.1
MOSI  (via drill 0.61)
  Top 0.305: U$3.10 34.59,30.93 v34.59,20.45
  Bottom 0.305: v34.59,20.45 35.99,20.45 37.9,18.54 37.9,14.48 37.13,13.72 35.61,13.72 ICSP.4
N$1
  Top 0.305: RRST.1 46.53,33.15 C1.2 43.51,33.63 U$3.13
N$2
  Top 0.305: J2.3 VD4.2
N$3
  Top 0.305: J2.2 5.51,54.1 13.89,54.1 VD2.2
N$4
  Top 0.305: U$3.3 28.86,30.96 28.86,29.7 25.2,26.05 RUSB1.1
N$5
  Top 0.305: U$3.4 29.69,30.96 29.69,29.17 27.46,26.81 RUSB2.1
N$6
  Bottom 0.356: Q1.3 41.45,59.56 39.55,57.66 37.9,57.66 DISP.6
N$7
  Bottom 0.305: D2.4 19.27,54.15 22.99,54.15 23.55,53.59 R_LED.2
N$8
  Top 0.305: U$3.17 38.84,36.83 43.23,41.27 43.31,42.95 43.94,42.98 C4.2 44.08,43.12 45.34,44.37 48.55,44.37 Y1.2
N$9
  Top 0.305: U$3.16 37.1,36.13 40.59,36.13 43.94,39.48 C5.2 44.08,39.48 48.55,39.48 Y1.1
N$10
  Top 0.305: X2.2 24.45,8.27 25.7,9.53 25.7,22.1 RUSB1.2
N$11
  Top 0.305: X2.3 24.94,7.62 26.59,9.27 26.59,20.95 RUSB2.2
N$12
  Top 0.305: Q1.2 35.86,61.59 R1.2
N$13
  Top 0.305: J3.12 47.44,21.18 44.8,21.18 JP2.1
N$14
  Top 0.305: T_ZERO_N.2 41.58,28.45 R2.1
N$15
  Top 0.305: R10.1 40.18,19.68 Q3.2
N$16
  Top 0.914: D1.A 8.46,40.6 10.55,40.6 13.49,37.67 13.49,36.97 Q2.3
N$17
  Top 0.305: R13.2 50.23,2.46 48.55,2.46 47.3,3.72 T_SHIFTER1.2
N$18
  Top 0.305: T_ZERO_N.3 43.99,25.15 42.6,23.75 38.92,23.75 R10.2
  Bottom 0.305: R3.2 43.99,22.86 T_ZERO_N.3
N$19  (1 unrouted)
N$20
  Top 0.305: 31.23,30.96 U$3.6
  Top 0.356: 31.23,30.96 31.23,26.3 C2.2
N$22  (via drill 0.61)
  Top 0.305: 25.07,2.41 C3.1 25.83,2.41
  Top 0.356: S2.3 32.74,1.27 26.21,1.27 25.07,2.41 | 25.83,2.41 28.75,5.84 28.75,17.91 32.05,21.21 32.09,21.68 U$3.7
  Top 0.406: X2.1 23.96,8.92 24.56,9.65 v24.56,12.57 | v22.4,1.78 24.18,1.78 C3.1
  Bottom 0.406: v24.56,12.57 24.56,3.94 v22.4,1.78
N$23
  Bottom 0.305: R14.1 41.57,4.98 41.57,2.6 R15.1 41.71,2.46 45.2,2.46 T_SHIFTER1.3
N$24
  Bottom 0.305: R14.2 38.91,5.12 38.91,6.93 40.16,8.18 T_SHIFTER2.2
N$31
  Top 0.305: R18.2 18.52,43.4 18.52,46.33 T_HSS.2
N$32
  Bottom 0.305: R21.1 31.29,57.66 28.75,60.33 T_CAM3.2
N$33
  Bottom 0.305: X1.2 12.37,60.86 15.3,60.86 15.44,60.72 16.98,60.72 18.52,62.26 SHTR.2 18.59,59.69 T_CAM4.3
N$34
  Top 0.305: X1.3 9.18,63.08 9.51,63.34 11.68,63.35 14.77,63.35 16,62.12 SHTR.3 16.05,62.23 17.58,60.71 25.2,60.71 T_CAM3.3
N$35
  Bottom 0.305: R20.1 21.64,56.01 T_CAM4.2
N$36
  Top 0.305: Q2.1 15.72,44.23 15.72,46.19 15.02,46.89 R17.2 15.58,46.47 17.26,48.15 T_HSS.3
RST  (via drill 0.61)
  Top 0.305: C1.1 45.52,28.7 45.52,23.24 44.56,22.16 JP2.2 42.91,22.86 v36.37,22.86
  Bottom 0.305: v36.37,22.86 33.96,22.86 31.29,20.32 ICSP.5
RX  (via drill 0.61 pad 0.41)
  Top 0.305: U$3.20 35.09,39.23 v34.34,38.48 | R16.1 41.45,5.84 39.8,7.49 39.8,9.91 39.93,9.91 T_SHIFTER2.3
  Bottom 0.305: T_SHIFTER2.3 38.53,12.7 38.66,29.72 34.34,33.91 v34.34,38.48
SCK
  Top 0.305: U$3.9 33.58,30.92 33.58,18.54 ICSP.3
SCL  (via drill 0.61)
  Top 0.305: U$3.18 38.32,37.63 41.96,41.27 v41.96,42.93 | R8.1 DISP.2
  Bottom 0.305: v41.96,42.93 40.69,44.2 40.69,46.23 40.82,46.35 RTC1.8 40.82,48.13 43.1,50.42 44.88,50.42 46.53,51.94 DISP.2 46.79,56.13 48.06,57.4 49.84,57.4 50.72,58.29 50.72,61.09 50.22,61.59 U1.2
SDA  (via drill 0.61)
  Top 0.305: U$3.19 38.1,38.43 40.82,41.15 40.82,43.31 v42.09,44.58 | R9.2 49.07,58.29 DISP.1
  Bottom 0.305: v42.09,44.58 RTC1.7 42.09,47.88 43.74,49.78 45.26,49.78 49.07,53.47 DISP.1 50.09,55.63 51.61,57.15 51.61,62.23 50.98,62.87 U1.1
TX  (via drill 0.61)
  Top 0.305: U$3.21 38.18,40.03 v39.42,41.27
  Bottom 0.305: v39.42,41.27 45.9,41.27 46.53,40.64 R12.1
VBAT
  Bottom 0.356: RTC1.6 43.36,48.01 44.12,48.77 45.77,48.77 49.07,52.07 50.22,52.07 J1.1
VCC  (via drill 0.61, 0.61 pad 0.41)
  Top 0.356: RB2.2 22.57,16.57 22.57,20.21 RB3.2 22.57,20.34 22.57,24.12 RB4.2 22.57,24.26 22.57,27.47 v22.91,27.81 25.7,27.81 28.02,30.12 28.02,30.96 U$3.2 28.02,31.1 28.02,33.02 | 28.03,39.19 26.48,40.74 25.5,40.74 U$3.34 24.25,40.83 23.67,41.4 v23.67,43.18 | 36.96,34.45 U$3.14 | U$3.44 25.5,32.92 27.91,32.92 28.02,33.02 | R16.2 41.43,2.32 38.55,5.46 38.53,5.46 | 12.23,29.29 13.35,30.4 13.35,31.66 RB5.2 | 12.23,29.29 RB1.2 | v37.24,47.03 34.58,44.37 34.58,42.7 U$3.24 | 38.53,5.46 34.47,5.46 32.56,4.06 S2.2 | 28.02,33.02 28.02,34.29 | 28.02,34.29 28.02,34.91 28.03,34.92 28.03,39.19 | 25.52,34.45 U$3.42 25.5,34.45 27.85,34.45 28.02,34.29 | 28.03,39.19 28.04,39.19 32.82,34.42 37.08,34.42 U$3.14 | 12.23,29.29 11.43,29.29 v9.83,27.69 | J10.2 38.53,12.37 | 38.53,12.37 38.53,12.7 ICSP.2 | 38.53,12.37 38.53,5.46 | R9.1 R8.2 45.39,62.36 43.99,60.96 43.99,59.44 42.47,57.91 40.69,57.91 Q1.1 | RRST.2 48.82,35.94 46.41,35.94 45.52,35.05 42.72,35.05 42.09,34.42 37.11,34.42 U$3.14
  Bottom 0.356: D2.1 14.15,51.05 19.7,50.98 23.27,47.03 23.67,47.03 | 39.79,22.86 39.8,31.24 37.25,33.29 37.24,46.89 v37.24,47.03 | 39.79,22.86 | 39.79,22.86 39.79,19.82 39.79,18.94 Q3.1 40.18,15.42 J10.2 | R15.2 38.15,1.91 33.45,1.91 32.56,2.79 S2.2 | 23.67,47.03 v37.24,47.03 | v37.24,47.03 36.26,48.01 34.61,49.64 34.59,53.85 34.59,57.28 37.01,59.69 Q1.1 38.41,60.2 38.41,62.48 39.42,63.5 41.45,63.5 42.09,62.87 U1.8 | v23.67,43.18 23.67,47.03 | v9.83,27.69 22.78,27.69 v22.91,27.81 | RTC1.2 42.09,51.18 37.64,46.99 37.27,46.99 v37.24,47.03 | R3.1 39.79,22.86
VD_DIRECT
  Top 0.305: VD5.1 VD6.2 12.24,52.2 13.64,50.8 29.13,50.8 30.53,49.4 30.53,42.67 U$3.29
ZERO_EN
  Top 0.305: U$3.12 37.16,32.77 38.02,32.77 38.78,32.01 R2.2
ZRX
  Bottom 0.305: J3.9 50.09,18.8 51.61,20.32 51.61,32 50.34,33.27 R11.1 R12.2
ZTX
  Top 0.305: R13.1 50.37,5.26 50.37,6.66 51.49,7.77 51.49,14.48 50.09,15.88 J3.7

### Text on the board
tPlace: G | VCC | 3.3V | GND | GND | - | + | 3 | TIME | BOX | 5V | compressed | time.de | ZERO | RST | BATT | USB
bPlace: + | - | - | + | - | + | BATT | USB